# EAGLE design Switch Board (EAGLE 5.10)
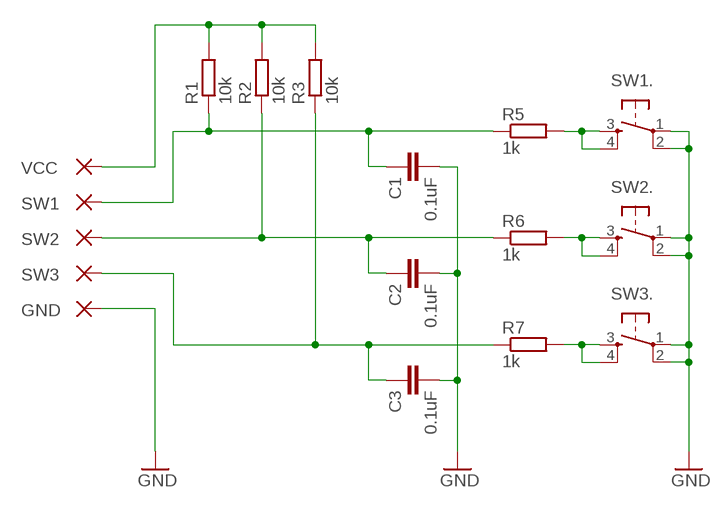
[diagram p0: schematic, sheet 1]

## Parts
C1  0.1uF  C-EUC0402  [C0402]
C2  0.1uF  C-EUC0402  [C0402]
C3  0.1uF  C-EUC0402  [C0402]
GND  SMD2  [SMD1,27-2,54]
R1  10k  R-EU_R0402  [R0402]
R2  10k  R-EU_R0402  [R0402]
R3  10k  R-EU_R0402  [R0402]
R5  1k  R-EU_R0402  [R0402]
R6  1k  R-EU_R0402  [R0402]
R7  1k  R-EU_R0402  [R0402]
SW1  SMD2  [SMD1,27-2,54]
SW1.  TSKB-2JL  [TSKB-2JL]
SW2  SMD2  [SMD1,27-2,54]
SW2.  TSKB-2JL  [TSKB-2JL]
SW3  SMD2  [SMD1,27-2,54]
SW3.  TSKB-2JL  [TSKB-2JL]
VCC  SMD2  [SMD1,27-2,54]

## Nets
GND: C1.2 C2.2 C3.2 GND.1(P) SW1..1(P) SW1..2(P1) SW2..1(P) SW2..2(P1) SW3..1(P) SW3..2(P1)
N$1: R5.2 SW1..3(S) SW1..4(S1)
N$2: R6.2 SW2..3(S) SW2..4(S1)
N$3: R1.2 R2.2 R3.2 VCC.1(P)
N$4: C1.1 R1.1 R5.1 SW1.1(P)
N$5: C2.1 R2.1 R6.1 SW2.1(P)
N$6: R7.2 SW3..3(S) SW3..4(S1)
N$7: C3.1 R3.1 R7.1 SW3.1(P)

## Library data of the parts
C1-C3 = resistor:C-EU: CAPACITOR, European symbol
GND SW1-SW3 VCC = wirepad:SMD2: SMD PAD
R1-R3 R5-R7 = resistor:R-EU_: RESISTOR, European symbol
SW1. SW2. SW3. = smd_switch:TSKB-2JL: SMD Tacting Switch

## Board
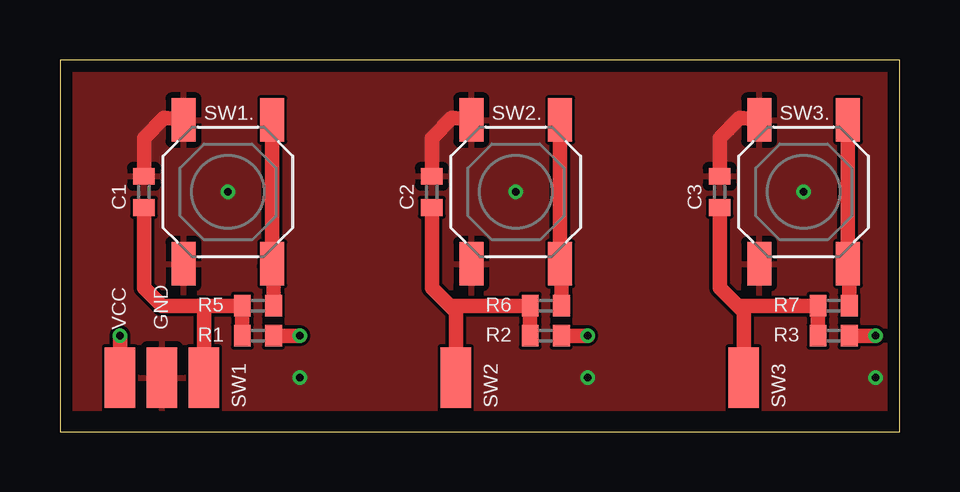
[diagram p1: board, top side]
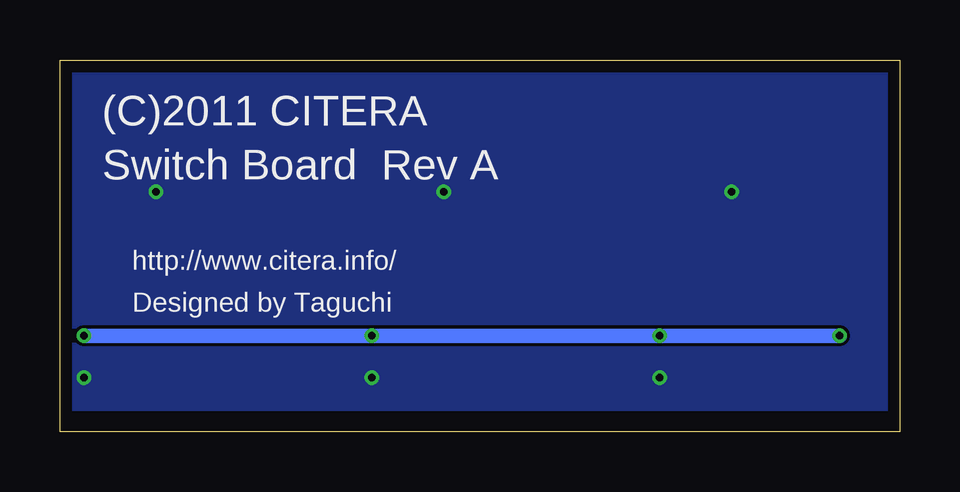
[diagram p2: board, bottom side, seen from below]

Size 35 x 15.5 mm. Coordinates in mm from the lower left corner, seen from the top.
Outline: 0,0 35,0 35,15.5 0,15.5 0,0
Copper layers (1+2*15+16): Top 0.018mm / dielectric 0.25mm / Route2 0.035mm / dielectric 1mm / Route15 0.035mm / dielectric 0.25mm / Bottom 0.018mm
Design rules "pban_5mil-l4": minimum track width 5mil, minimum drill 0.3mm, track to track 5mil, track to pad 0.229mm, pad to pad 5mil, via to via 5mil, smd to smd 5mil, copper to edge 0.5mm, drill to drill 0.5mm, minimum pad ring 0.15mm, minimum via ring 0.15mm, stop-mask expansion 4mil, vias tented up to drill 0.35mm, thermal gap 10mil

### Footprints (pad centres in the part's own frame; a part is rotated, then mirrored left to right if it is on the bottom)
C0402 = smd 0.7 x 0.9: 1 -0.65,0; 2 0.65,0
SMD1,27-2,54 = smd 1.27 x 2.54: 1 0,0
R0402 = smd 0.7 x 0.9: 1 -0.65,0; 2 0.65,0
TSKB-2JL = smd 1.8 x 1: 1 -3,1.85; 2 3,1.85; 3 -3,-1.85; 4 3,-1.85

### Placement (x,y rotation side)
C1  3.5,10 90 top
C2  15.5,10 90 top
C3  27.5,10 90 top
GND  4.25,2.25 0 top
R1  8.25,4 0 top
R2  20.25,4 0 top
R3  32.25,4 0 top
R5  8.25,5.25 0 top
R6  20.25,5.25 0 top
R7  32.25,5.25 0 top
SW1  6,2.25 0 top
SW1.  7,10 90 top
SW2  16.5,2.25 0 top
SW2.  19,10 90 top
SW3  28.5,2.25 0 top
SW3.  31,10 90 top
VCC  2.5,2.25 0 top

### Tracks (layer width: path | path; a pad name or v marks a point on that pad's centre or on a via)
GND  (via drill 0.3)
  Top 0.61: C1.2 3.5,12.25 4.35,13.1 SW1..2 | C2.2 15.5,12.25 16.35,13.1 SW2..2 | C3.2 27.5,12.25 28.35,13.1 SW3..2
  other vias: 7,10 19,10 31,10 10,2.25 22,2.25 34,2.25
  pour Top (isolate 0.13): 0.5,15 0.5,1 34.5,1 34.5,15
  pour Bottom (isolate 0.13): 0.5,15 34.5,15 34.5,1 0.5,1
N$1
  Top 0.61: SW1..3 SW1..4 | SW1..3 8.65,6.9 | R5.2 8.9,6.9 SW1..3
N$2
  Top 0.61: SW2..4 SW2..3 20.9,6.9 R6.2
N$3  (via drill 0.3)
  Top 0.61: v10,4 R1.2 | v22,4 R2.2 | v34,4 R3.2 | VCC.1 v2.5,4
  Bottom 0.61: v34,4 v22,4 v10,4 v2.5,4
N$4
  Top 0.61: C1.1 3.5,6 4.25,5.25 6,5.25 | R1.1 R5.1 6,5.25 | SW1.1 6,5.25
N$5
  Top 0.61: C2.1 15.5,6 16.25,5.25 | R2.1 R6.1 16.25,5.25 | SW2.1 16.5,5 16.25,5.25
N$6
  Top 0.61: SW3..4 SW3..3 32.9,6.9 R7.2
N$7
  Top 0.61: C3.1 27.5,6 28.25,5.25 | R3.1 R7.1 28.25,5.25 | SW3.1 28.5,5 28.25,5.25

### Text on the board
bPlace: (C)2011 CITERA | Switch Board Rev A | http://www.citera.info/ | Designed by Taguchi